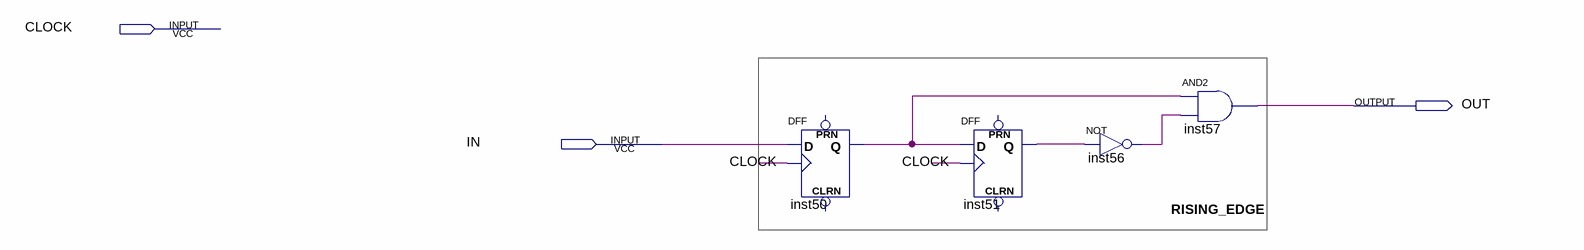
[diagram p0: schematic sheet]
// Quartus schematic RISING_EDGE.bdf as structural Verilog: 4 symbols, 3 pins
module RISING_EDGE (
  input  CLOCK,
  input  IN,
  output OUT
);

  wire inst50_q, inst51_q, inst56_out;

  DFF inst50 (.CLK(CLOCK), .D(IN), .Q(inst50_q));  // open: CLRN, PRN
  DFF inst51 (.CLK(CLOCK), .D(inst50_q), .Q(inst51_q));  // open: CLRN, PRN
  not inst56 (inst56_out, inst51_q);
  and inst57 (OUT, inst50_q, inst56_out);

  // Notes on the sheet:
  //   RISING_EDGE
endmodule
